# EAGLE design tdcs (EAGLE 7.5.0)
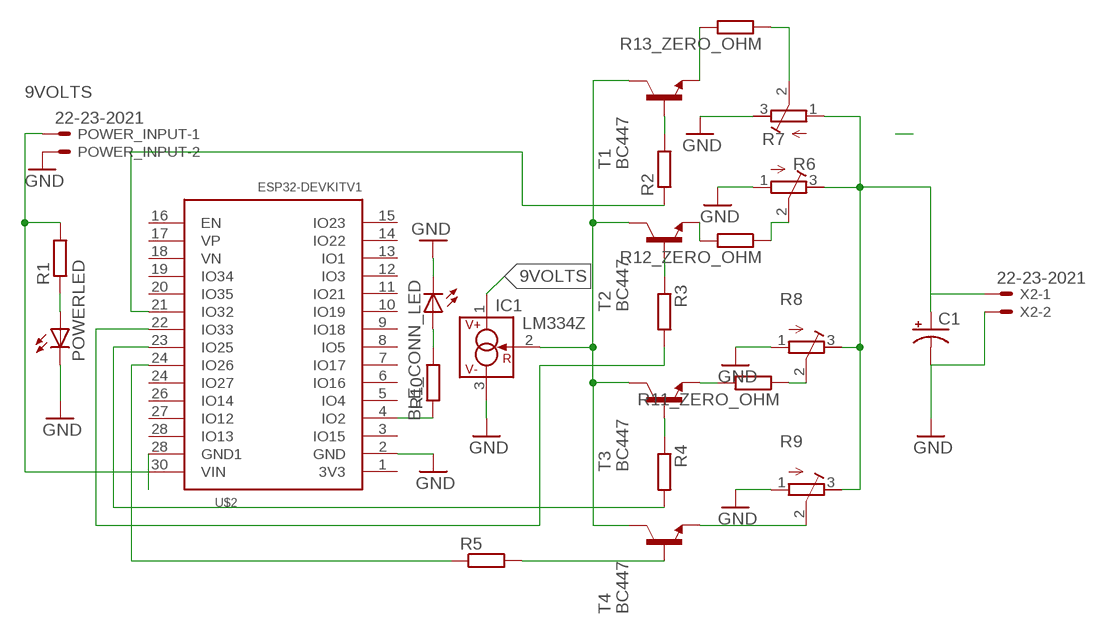
[diagram p0: schematic, sheet 1]

## Parts
BLE_CONN_LED  LED3MM  [LED3MM]
C1  CPOL-USE1.8-4  [E1,8-4]
IC1  LM334Z  [TO92]
POWER_INPUT  22-23-2021  [22-23-2021]
POWERLED  LEDB152  [Q62902-B152]
R1  R-EU_0204/5  [0204/5]
R2  R-EU_0204/5  [0204/5]
R3  R-EU_0204/5  [0204/5]
R4  R-EU_0204/5  [0204/5]
R5  R-EU_0204/5  [0204/5]
R6  R-TRIMM64W  [RTRIM64W]
R7  R-TRIMM64W  [RTRIM64W]
R8  R-TRIMM64W  [RTRIM64W]
R9  R-TRIMM64W  [RTRIM64W]
R10  R-EU_0204/5  [0204/5]
R11_ZERO_OHM  R-EU_0204/5  [0204/5]
R12_ZERO_OHM  R-EU_0204/5  [0204/5]
R13_ZERO_OHM  R-EU_0204/5  [0204/5]
T1  BC447  [TO92-EBC]
T2  BC447  [TO92-EBC]
T3  BC447  [TO92-EBC]
T4  BC447  [TO92-EBC]
U$2  ESP32DEVKITV1  [ESP32-DEVKITV1]
X2  22-23-2021  [22-23-2021]

## Nets
9VOLTS: IC1.1(V+) POWER_INPUT.1 R1.2 U$2.30(VIN)
GND: BLE_CONN_LED.K(C) C1.- IC1.3(V-) POWER_INPUT.2 POWERLED.K(C) R6.3(E) R7.1(A) R8.1(A) R9.1(A) U$2.2(GND) X2.2
N$1: R2.2 T1.B
N$2: R3.1 T2.B
N$3: R4.1 T3.B
N$4: R5.1 U$2.24(IO26)
N$5: IC1.2(R) T1.C T2.C T3.C T4.C
N$6: BLE_CONN_LED.A R10.2
N$7: R3.2 U$2.22(IO33)
N$8: R4.2 U$2.23(IO25)
N$9: R5.2 T4.B
N$10: R9.2(S) T4.E
N$11: R11_ZERO_OHM.2 T3.E
N$12: R7.2(S) R12_ZERO_OHM.1
N$14: C1.+ R6.1(A) R7.3(E) R8.3(E) R9.3(E) X2.1
N$15: R10.1 U$2.4(IO2)
N$16: POWERLED.A R1.1
N$17: R8.2(S) R11_ZERO_OHM.1
N$18: R12_ZERO_OHM.2 T2.E
N$19: R13_ZERO_OHM.2 T1.E
N$20: R6.2(S) R13_ZERO_OHM.1
N$21: U$2.28(GND1)
N$99: R2.1 U$2.21(IO32)
Unconnected: U$2.1(3V3) U$2.3(IO15) U$2.5(IO4) U$2.6(IO16) U$2.7(IO17) U$2.8(IO5) U$2.9(IO18) U$2.10(IO19) U$2.11(IO21) U$2.12(IO3) U$2.13(IO1) U$2.14(IO22) U$2.15(IO23) U$2.16(EN) U$2.17(VP) U$2.18(VN) U$2.19(IO34) U$2.20(IO35) U$2.24(IO27) U$2.26(IO14) U$2.27(IO12) U$2.28(IO13)

## Library data of the parts
BLE_CONN_LED POWERLED = led:LED: LED OSRAM: - CHIPLED LG R971, LG N971, LY N971, LG Q971, LY Q971, LO R971, LY R971 LH N974, LH R974 LS Q976, LO Q976, LY Q976 LO Q996 - Hyper CHIPLED LW Q18S LB Q993, LB Q99A, LB R99A - SideLED LS A670, LO A670, LY A670, LG A670, LP A670 LB A673, LV A673, LT A673, LW A673 LH A674 LY A675 LS A676, LA A676, LO A676, LY A676, LW A676 LS A679, LY A679, LG A679 - Hyper Micro SIDELED® LS Y876, LA Y876, LO Y876, LY Y876 LT Y87S - SmartLED LW L88C, LW L88S LB L89C, LB L89S, LG L890 LS L89K, LO L89K, LY L89K LS L896, LA L896, LO L896, LY L896 - TOPLED LS T670, LO T670, LY T670, LG T670, LP T670 LSG T670, LSP T670, LSY T670, LOP T670, LYG T670 LG T671, LOG T671, LSG T671 LB T673, LV T673, LT T673, LW T673 LH T674 LS T676, LA T676, LO T676, LY T676, LB T676, LH T676, LSB T676, LW T676 LB T67C, LV T67C, LT T67C, LS T67K, LO T67K, LY T67K, LW E67C LS E67B, LA E67B, LO E67B, LY E67B, LB E67C, LV E67C, LT E67C LW T67C LS T679, LY T679, LG T679 LS T770, LO T770, LY T770, LG T770, LP T770 LB T773, LV T773, LT T773, LW T773 LH T774 LS E675, LA E675, LY E675, LS T675 LS T776, LA T776, LO T776, LY T776, LB T776 LHGB T686 LT T68C, LB T68C - Hyper Mini TOPLED® LB M676 - Mini TOPLED Santana® LG M470 LS M47K, LO M47K, LY M47K Source: http://www.osram.convergy.de LUXEON: - LUMILED® LXK2-PW12-R00, LXK2-PW12-S00, LXK2-PW14-U00, LXK2-PW14-V00 LXK2-PM12-R00, LXK2-PM12-S00, LXK2-PM14-U00 LXK2-PE12-Q00, LXK2-PE12-R00, LXK2-PE12-S00, LXK2-PE14-T00, LXK2-PE14-U00 LXK2-PB12-K00, LXK2-PB12-L00, LXK2-PB12-M00, LXK2-PB14-N00, LXK2-PB14-P00, LXK2-PB14-Q00 LXK2-PR12-L00, LXK2-PR12-M00, LXK2-PR14-Q00, LXK2-PR14-R00 LXK2-PD12-Q00, LXK2-PD12-R00, LXK2-PD12-S00 LXK2-PH12-R00, LXK2-PH12-S00 LXK2-PL12-P00, LXK2-PL12-Q00, LXK2-PL12-R00 Source: www.luxeon.com KINGBRIGHT: KA-3528ASYC Source: www.kingbright.com
C1 = rcl:CPOL-US: POLARIZED CAPACITOR, American symbol
IC1 = linear:LM*34: 3-Terminal Adjustable Current Sources Source: www.national.com/pf/LM/LM334.html | LM134.pdf
POWER_INPUT X2 = con-molex:22-23-2021: .100" (2.54mm) Center Header - 2 Pin; MF: MOLEX; MPN: 22-23-2021; OC_FARNELL: 1462926; OC_NEWARK: 25C3832
R1-R5 R10 R11_ZERO_OHM R12_ZERO_OHM R13_ZERO_OHM = rcl:R-EU_: RESISTOR, European symbol
R6-R9 = rcl:R-TRIMM: Trimm resistor
T1-T4 = transistor-npn:BC447*: NPN Transistor
U$2 = ESP32-DEVKITV1:ESP32DEVKITV1

## Board
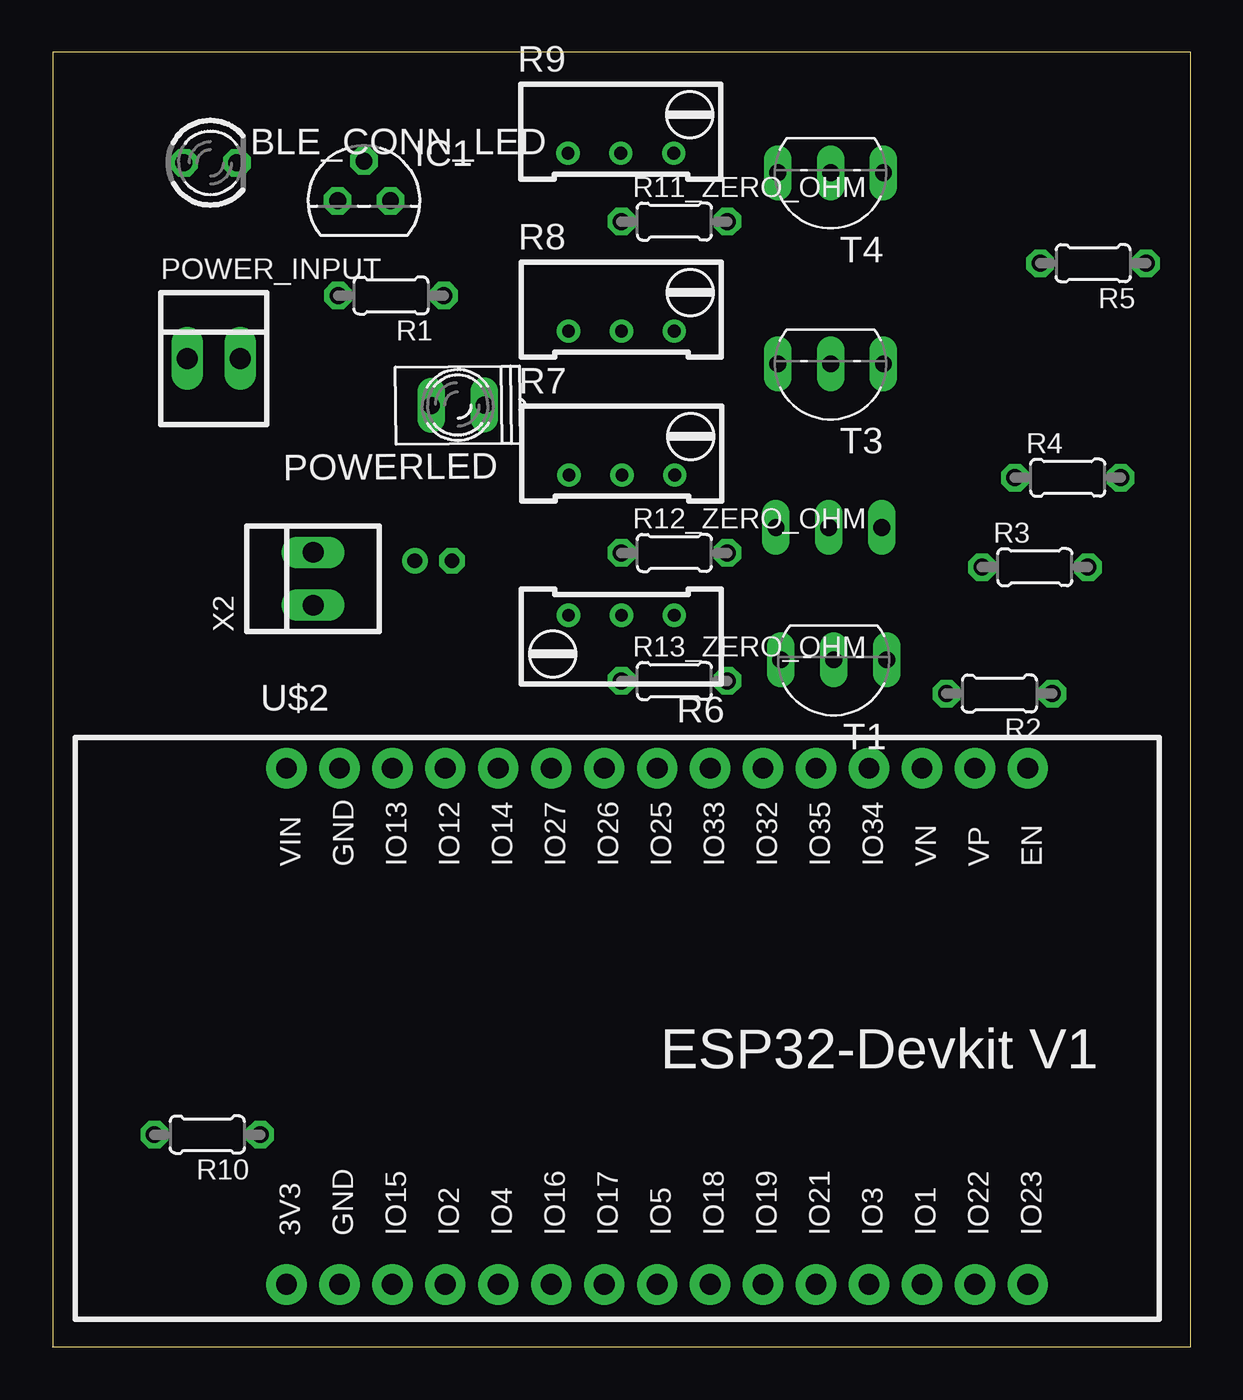
[diagram p1: board, top side]
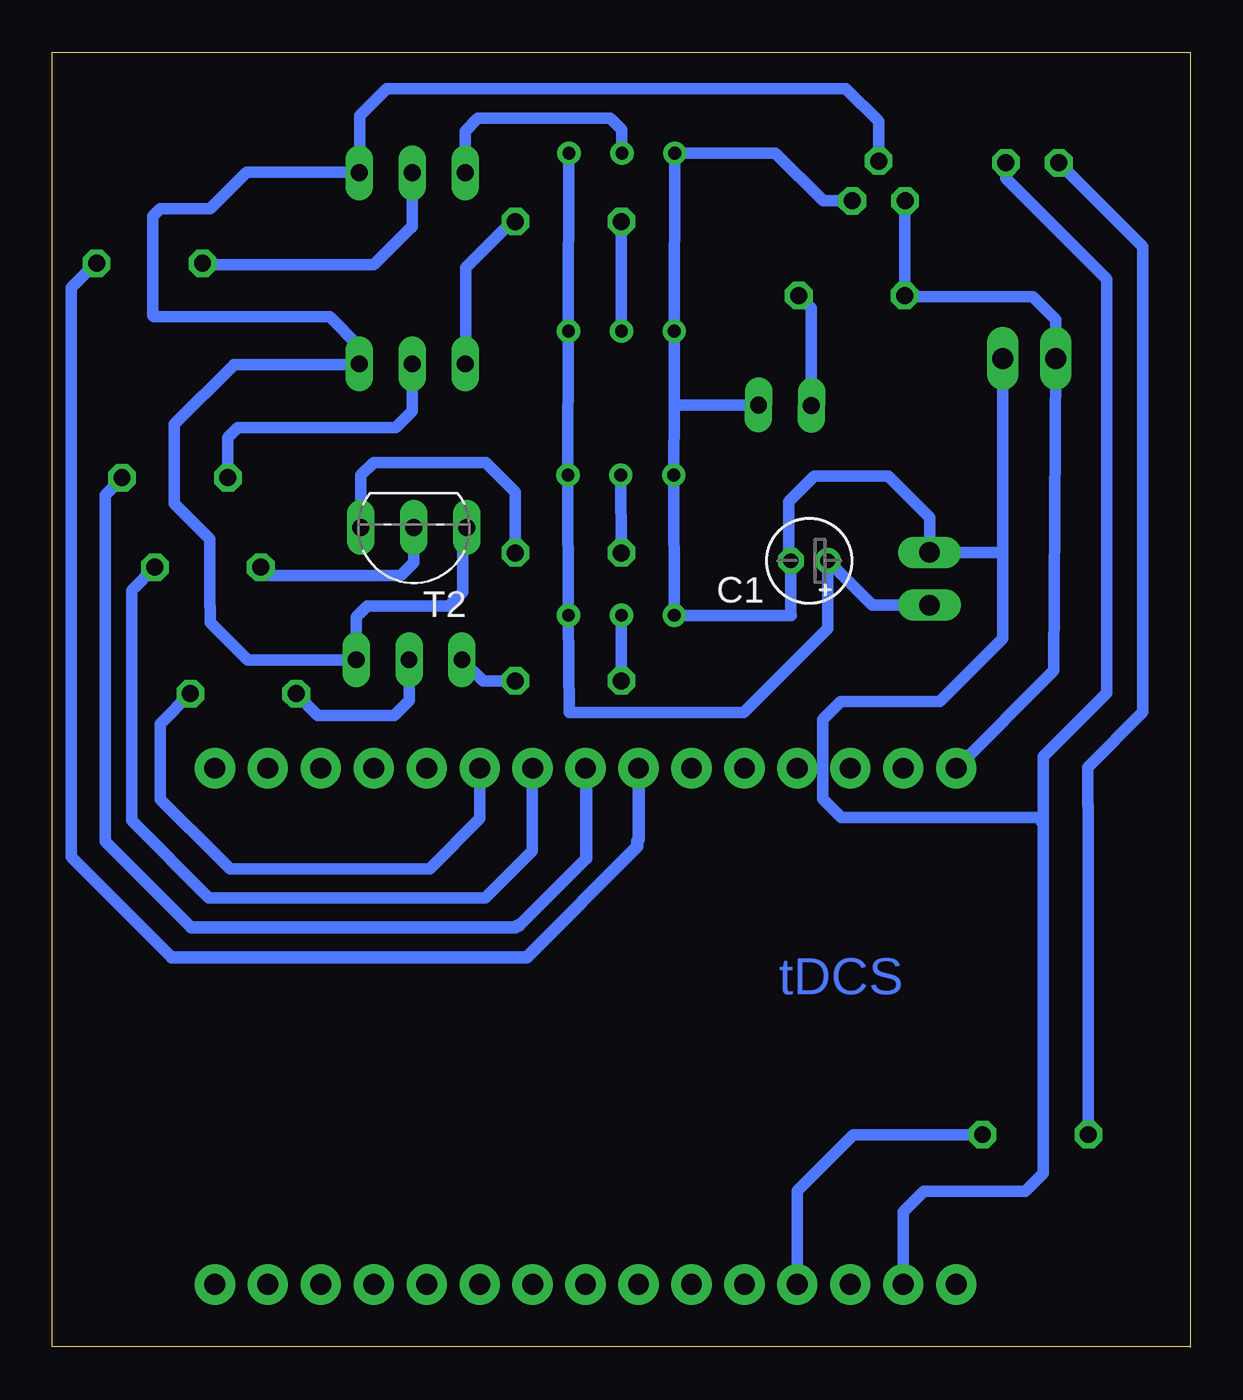
[diagram p2: board, bottom side, seen from below]

Size 54.61 x 62.15 mm. Coordinates in mm from the lower left corner, seen from the top.
Outline: 0,0.03 54.61,0.03 54.61,62.15 0.03,62.15 0.03,0
Copper layers (1*16): Top 0.035mm / dielectric 1.5mm / Bottom 0.035mm
Design rules "default *": minimum track width 24mil, minimum drill 0.00508125mm, track to track 18mil, track to pad 18mil, pad to pad 18mil, via to via 50mil, smd to smd 8mil, copper to edge 40mil, drill to drill 8mil, minimum pad ring 10mil, minimum via ring 8mil, stop-mask expansion 4mil, vias tented up to drill 0mil, thermal gap 10mil

### Footprints (pad centres in the part's own frame; a part is rotated, then mirrored left to right if it is on the bottom)
LED3MM = drill 0.813 octagon: A -1.27,0; K 1.27,0
E1,8-4 = drill 0.711 pad 1.168: + -0.889,0 | drill 0.711 pad 1.168 octagon: - 0.889,0
TO92 = drill 0.813 octagon: 1 -1.27,0; 2 0,1.905; 3 1.27,0
22-23-2021 = drill 1 long: 1 -1.27,0; 2 1.27,0
Q62902-B152 = drill 0.813 long: A 1.27,0; K -1.27,0
0204/5 = drill 0.813 octagon: 1 -2.54,0; 2 2.54,0
RTRIM64W = drill 0.61: 1 1.27,-2.54; 2 1.27,0; 3 1.27,2.54
TO92-EBC = drill 0.813 long: B 0,-1.27; C -2.54,-1.27; E 2.54,-1.27
ESP32-DEVKITV1 = drill 1 pad 1.93: 1 -22.87,-13.54; 2 -20.33,-13.54; 3 -17.79,-13.54; 4 -15.25,-13.54; 5 -12.71,-13.54; 6 -10.17,-13.54; 7 -7.63,-13.54; 8 -5.09,-13.54; 9 -2.55,-13.54; 10 -0.01,-13.54; 11 2.53,-13.54; 12 5.07,-13.54; 13 7.61,-13.54; 14 10.15,-13.54; 15 12.69,-13.54; 16 12.69,11.23; 17 10.15,11.23; 18 7.61,11.23; 19 5.07,11.23; 20 2.53,11.23; 21 -0.01,11.23; 22 -2.55,11.23; 23 -5.09,11.23; 24 -7.63,11.23; 25 -10.17,11.23; 26 -12.71,11.23; 27 -15.25,11.23; 28 -17.79,11.23; 29 -20.33,11.23; 30 -22.87,11.23

### Placement (x,y rotation side)
BLE_CONN_LED  7.59,56.85 0 top
C1  18.29,37.74 180 bottom
IC1  14.96,55.02 0 top
POWER_INPUT  7.75,47.45 0 top
POWERLED  19.46,45.21 180.5 top
R1  16.26,50.47 180 top
R2  45.44,31.37 180 top
R3  47.14,37.44 0 top
R4  48.72,41.73 0 top
R5  49.94,52.02 180 top
R6  27.3,33.86 90 top
R7  27.33,43.13 270 top
R8  27.3,50.04 270 top
R9  27.28,58.57 270 top
R10  7.44,10.21 180 top
R11_ZERO_OHM  29.84,54.03 0 top
R12_ZERO_OHM  29.84,38.13 0 top
R13_ZERO_OHM  29.84,31.98 0 top
T1  37.49,31.72 180 top
T2  37.26,38.07 180 bottom
T3  37.34,45.92 180 top
T4  37.34,55.09 180 top
U$2  34.11,16.56 0 top
X2  12.52,36.88 90 top

### Tracks (layer width: path | path; a pad name or v marks a point on that pad's centre or on a via)
9VOLTS
  Bottom 0.559: U$2.30 6.55,32.48 POWER_INPUT.1 6.48,49.33 7.57,50.42 13.67,50.42 R1.2 13.72,55.02 IC1.1
GND
  Bottom 0.559: R9.1 R8.1 24.78,45.26 | 24.78,45.26 R7.1 R6.3 19.15,35.13 19.18,35.15 C1.- 19.28,37.85 19.28,40.59 18.06,41.81 14.5,41.81 12.52,39.83 X2.2 9.12,38.15 9.02,38.05 | 24.69,57.35 R9.1 | BLE_CONN_LED.K 8.86,56.11 4.01,51.26 4.01,31.39 7.06,28.35 7.06,25.12 | 7.06,25.12 7.06,8.36 7.93,7.49 12.8,7.49 13.79,6.5 U$2.2 | POWER_INPUT.2 9.02,38.05 | 9.02,38.05 9.02,34.01 12.04,30.99 16.79,30.99 17.65,30.12 17.65,26.31 16.76,25.43 7.37,25.43 7.06,25.12 | IC1.3 17.63,55.02 19.91,57.3 R9.1 | POWERLED.K 24.74,45.22 24.78,45.26
N$1
  Bottom 0.559: T1.B 37.49,31.04 38.2,30.33 41.86,30.33 R2.2
N$2
  Bottom 0.559: T2.B 37.26,37.67 37.9,37.03 44.2,37.03 R3.1
N$3
  Bottom 0.559: R4.1 46.18,43.66 45.69,44.14 38.13,44.14 37.34,44.93 T3.B
N$4
  Bottom 0.406: U$2.24
  Bottom 0.559: R5.1 52.53,52.02 53.7,50.85 53.7,23.55 48.87,18.72
  Bottom 0.61: U$2.24 26.48,24.37 26.54,24.31 26.54,24.03 31.85,18.72 48.87,18.72
N$5
  Bottom 0.559: IC1.2 14.96,58.83 16.54,60.4 38.56,60.4 39.85,59.11 39.85,56.39 T4.C 39.9,56.39 45.26,56.39 47.02,54.64 49.43,54.64 49.78,54.28 49.78,49.5 49.73,49.45 41.3,49.45 39.88,48.03 T3.C 39.9,47.17 45.9,47.17 45.9,47.14 48.74,44.3 48.74,40.49 47.04,38.79 47.04,35.59 47.02,35.56 47.02,34.77 45.24,32.99 T1.C 40.03,35.05 39.5,35.59 35.59,35.59 34.93,36.25 34.93,39.14 T2.C
N$6
  Bottom 0.559: R10.2 4.9,25.98 4.93,26.01 4.93,27.84 2.29,30.48 2.29,52.81 BLE_CONN_LED.A
N$7
  Bottom 0.559: U$2.22 31.57,23.82 33.83,21.56 47.09,21.56 50.8,25.27 50.8,36.32 R3.2
N$8
  Bottom 0.559: R4.2 51.26,41.71 52.07,40.89 52.07,24.28 47.93,20.14
  Bottom 0.61: 47.93,20.14 32.39,20.14 32.28,20.24 32.21,20.24 28.98,23.47 28.98,27.75 U$2.23
N$9
  Bottom 0.559: T4.B 37.34,53.77 37.41,53.7 37.44,53.7 39.19,51.94 47.14,51.94 R5.2
N$10
  Bottom 0.559: R9.2 27.28,58.42 27.84,58.98 34.19,58.98 34.8,58.37 T4.E
N$11
  Bottom 0.559: R11_ZERO_OHM.2 32.61,53.97 34.77,51.82 34.77,47.22 T3.E
N$12
  Bottom 0.559: R7.2 R12_ZERO_OHM.1
N$14
  Bottom 0.559: R9.3 R8.3 R7.3 R6.1 29.79,30.45 21.44,30.45 17.4,34.49 C1.+ 15.27,35.61 X2.1
N$15
  Bottom 0.559: R10.1 16.18,10.21 18.87,7.52 U$2.4
N$16
  Bottom 0.559: POWERLED.A 18.19,49.86 R1.1
N$17
  Bottom 0.559: R8.2 R11_ZERO_OHM.1
N$18
  Bottom 0.559: R12_ZERO_OHM.2 32.39,41.05 33.81,42.47 39.19,42.47 39.8,41.86 T2.E
N$19
  Bottom 0.559: R13_ZERO_OHM.2 33.93,31.98 T1.E
N$20
  Bottom 0.559: R6.2 R13_ZERO_OHM.1
N$99
  Bottom 0.559: U$2.21 34.09,27.78 34.09,25.37 36.5,22.96 46.08,22.96 47.98,24.87 48.01,24.87 49.43,26.29 49.43,29.92 R2.1

### Text on the board
Bottom: tDCS